# EasyEDA Pro project ProPrj_LoRA Transmitter Atmega328u_2025-11-03.epro

# Schematic Schematic1
Board Name: Board1; Create Date: 2025-08-10; Page Name: P1; Project Name: LoRA Transmitter Atmega328u; Schematic Name: Schematic1; Update Date: 2025-08-22; Company: Phil Grant; Page Size: A4; Version: V1.0
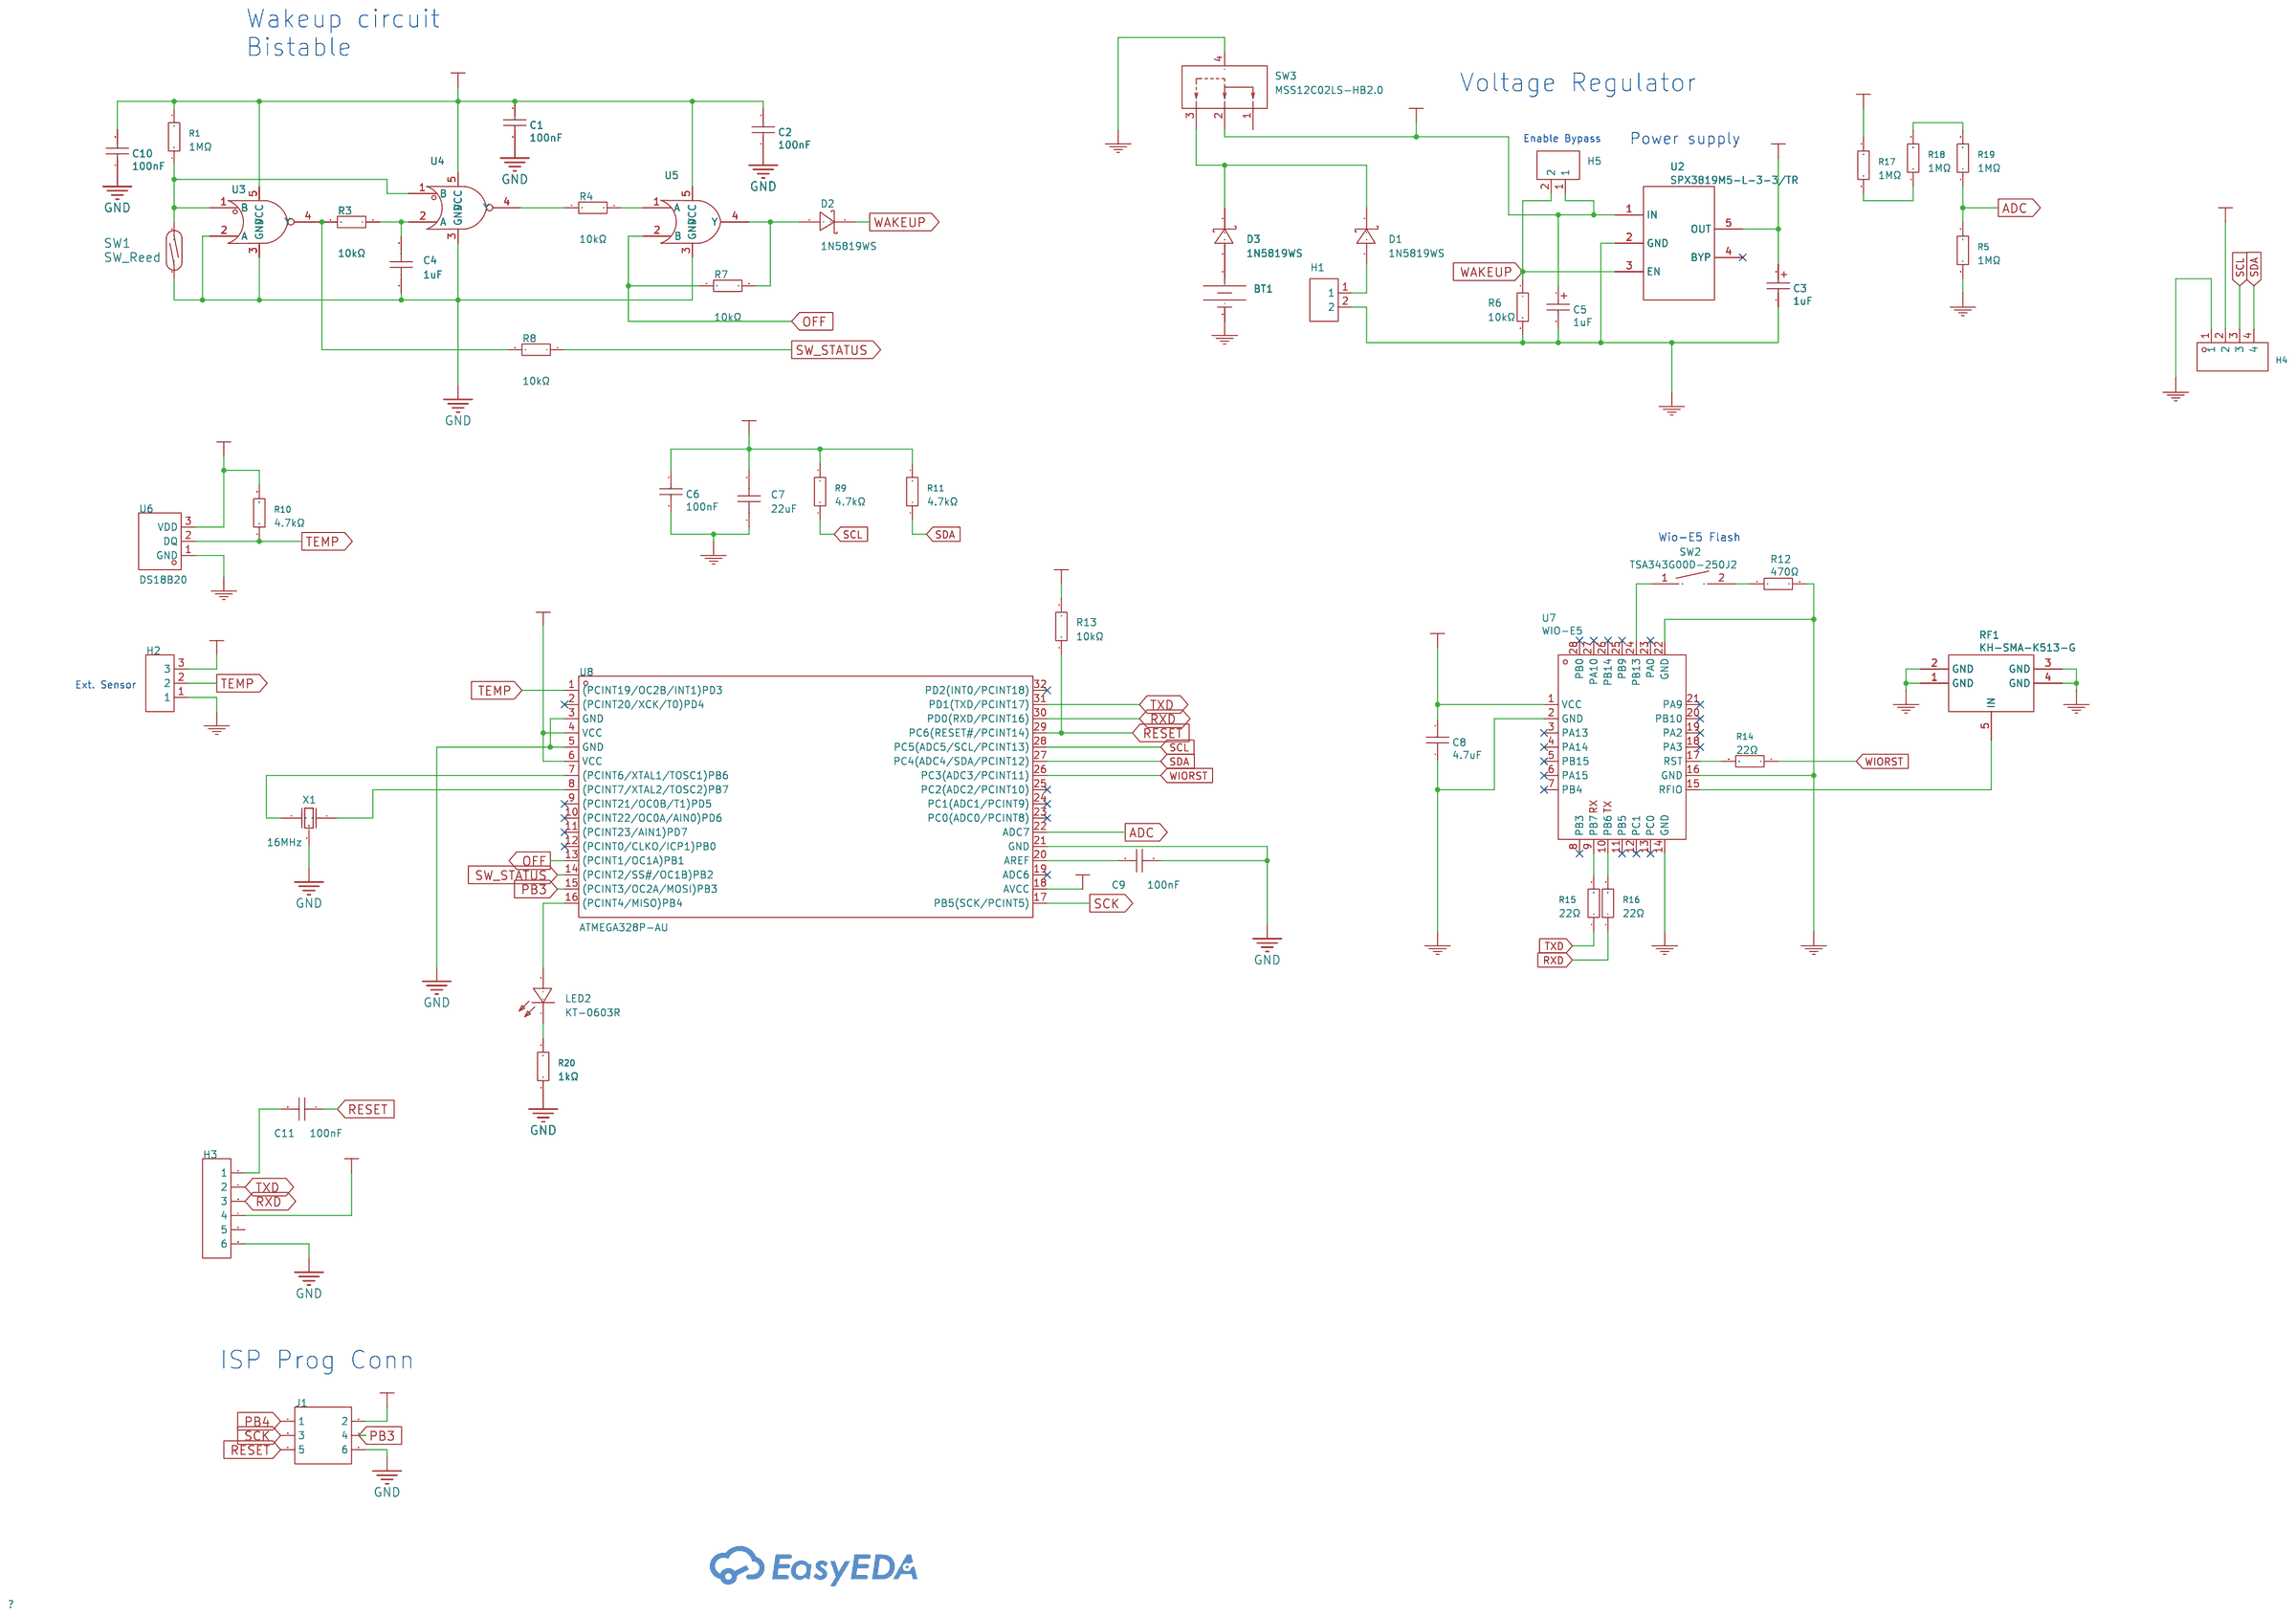
[diagram p0: schematic sheet]

## Parts
BT1  BH-18650-4  [BAT-SMD_BH-18650-4]  (no BOM)
C1  100nF  [C0402]
C2  100nF  [C0402]
C3  1uF  [CASE-A_3216]
C4  1uF  [C0402]
C5  1uF  [CASE-A_3216]
C6  100nF  [C0402]
C7  22uF  [C0603]
C8  4.7uF  [C0603]
C9  100nF  [C0402]
C10  100nF  [C0402]
C11  100nF  [C0402]
D1  1N5819WS  [SOD-323_L1.8-W1.3-LS2.5-RD]
D2  1N5819WS  [SOD-323_L1.8-W1.3-LS2.5-RD]
D3  1N5819WS  [SOD-323_L1.8-W1.3-LS2.5-RD]
H1  PZ254V-11-02P  [HDR-TH_2P-P2.54-V-M]  (no BOM)
H2  PZ254V-11-03P  [HDR-TH_3P-P2.54-V-M]  (no BOM)
H3  2.54-1x6P直针  [HDR-TH_6P-P2.54-V-M-1]  (no BOM)
H4  PZ254V-11-04P  [HDR-TH_4P-P2.54-V-M]  (no BOM)
H5  PZ254V-11-02P  [HDR-TH_2P-P2.54-V-M]  (no BOM)
J1  2.54-2*3P针  [HDR-TH_6P-P2.54-V-M-R2-C3-S2.54-1]  (no BOM)
LED2  KT-0603R  [LED0603-RD]
R1  1MΩ  [R0402]
R3  10kΩ  [R0402]
R4  10kΩ  [R0402]
R5  1MΩ  [R0402]
R6  10kΩ  [R0402]  (no BOM)
R7  10kΩ  [R0402]
R8  10kΩ  [R0402]
R9  4.7kΩ  [R0402]
R10  4.7kΩ  [R0402]
R11  4.7kΩ  [R0402]
R12  470Ω  [R0603]
R13  10kΩ  [R0402]
R14  22Ω  [R0402]
R15  22Ω  [R0402]
R16  22Ω  [R0402]
R17  1MΩ  [R0402]
R18  1MΩ  [R0402]
R19  1MΩ  [R0402]
R20  1kΩ  [R0402]
RF1  KH-SMA-K513-G  [ANT-TH_KH-SMA-K513-G]  (no BOM)
SW1  SW_Reed  [SW-SMD_2P-L17.0-W3.1_REED_SWITCH_17MM]  (no BOM)
SW2  TSA343G00D-250J2  [SW-SMD_L4.0-W2.9-P4.15-EH]
SW3  MSS12C02LS-HB2.0  [SW-SMD_MSS12C02LS-HB2.0-1]
U2  SPX3819M5-L-3-3/TR  [SOT-23-5_L3.0-W1.7-P0.95-LS2.8-BL]
U3  74AHC1G86GW,125  [SOT-353-5_L2.0-W1.3-P0.65-LS2.1-BR]
U4  74AHC1G86GW,125  [SOT-353-5_L2.0-W1.3-P0.65-LS2.1-BR]
U5  SN74AHC1G32DBVR  [SOT-23-5_L3.0-W1.7-P0.95-LS2.8-BR]
U6  DS18B20  [TO-92-3_L4.5-W3.5-P1.27-L]  (no BOM)
U7  WIO-E5  [SMD-28_L12.0-W12.0-P1.25_LORA-E5]  (no BOM)
U8  ATMEGA328P-AU  [TQFP-32_L7.0-W7.0-P0.80-LS9.0-BL]
X1  16MHz  [OSC-SMD_3P-L3.2-W1.3-P1.20-L]

## Library data of the parts
BT1 = BH-18650-4: Supplier Part: C49118399; Manufacturer: HanElectricity(瀚源); Supplier Footprint: SMD; JLCPCB Part Class: Extended Part; Datasheet: https://atta.szlcsc.com/upload/public/pdf/source/20250610/E24A298F5E17B230207136FA3E112EAA.pdf; Supplier: LCSC
C1 C2 C6 C9-C11 = CL05B104KO5NNNC: Capacitance: Tolerance:±10% Tolerance:±10% Voltage Rated: Temperature Coefficient:; LCSC Part Name: 100nF ±10% 16V; Supplier Part: C1525; Manufacturer: SAMSUNG(三星); Supplier Footprint: 0402; JLCPCB Part Class: Basic Part; Datasheet: https://atta.szlcsc.com/upload/public/pdf/source/20160218/1457707763339.pdf; Supplier: LCSC; Tolerance: ±10%
C3 C5 = 1uF: Supplier: LCSC; Manufacturer: Kyocera AVX; Manufacturer Part: TAJA105K035RNJ; Supplier Part: C7176; JLCPCB Part Class: Extended Part
C4 = CL05A105KA5NQNC: Capacitance:1uF Tolerance:±10% Tolerance:±10% Voltage Rating:25V Temperature Coefficient:X5R; LCSC Part Name: 1uF ±10% 25V; Supplier Part: C52923; Manufacturer: SAMSUNG(三星); Supplier Footprint: 0402; JLCPCB Part Class: Basic Part; Datasheet: https://item.szlcsc.com/datasheet/CL05A105KA5NQNC/53938.html; Supplier: LCSC; Tolerance: ±10%; Voltage Rating: 25V; Temperature Coefficient: X5R
C7 = CL10A226MQ8NRNC: Capacitance: Tolerance:±20% Tolerance:±20% Voltage Rated: Temperature Coefficient:; LCSC Part Name: 22uF ±20% 6.3V; Supplier Part: C59461; Manufacturer: SAMSUNG(三星); Supplier Footprint: 0603; JLCPCB Part Class: Basic Part; Datasheet: https://atta.szlcsc.com/upload/public/pdf/source/20160218/1457707763339.pdf; Supplier: LCSC; Tolerance: ±20%
C8 = 4.7uF: Supplier: LCSC; Manufacturer Part: CL10A475KO8NNNC; Manufacturer: SAMSUNG(三星); Supplier Part: C19666; JLCPCB Part Class: Basic Part
D1-D3 = 1N5819WS_C191023: Forward Voltage (Vf@If):600mV@1A Reverse Voltage (Vr):40V Rectified Current:1A; LCSC Part Name: 电压:40V 电流:1A; Supplier Part: C191023; Manufacturer: Hottech(合科泰); Supplier Footprint: SOD-323; JLCPCB Part Class: Basic Part; Datasheet: https://atta.szlcsc.com/upload/public/pdf/source/20220428/3CB86FD8D28D653594B4E35F9D5AEFD9.pdf; Supplier: LCSC; Forward Voltage (Vf@If): 600mV@1A; Reverse Voltage (Vr): 40V; Rectified Current: 1A
H1 H5 = PZ254V-11-02P: Pin Structure:1x2P Pitch:2.54mm Row Spacing:- Circluar Pins/Square Pins:Policy Mounting Type:Straight Number of Rows:Single Row Number of Pins:2P Current Rating:- Voltage Rating (Max):- Length of Mating Pin:6mm Insulation Height:2.5mm Length of End Connec; LCSC Part Name: 1x2P 间距:2.54mm 方针 直插; Supplier Part: C492401; Manufacturer: XFCN(兴飞); Supplier Footprint: 插件,P=2.54mm; JLCPCB Part Class: Extended Part; Datasheet: https://atta.szlcsc.com/upload/public/pdf/source/20200309/C492401_A812433581A9B211A7FFA413ADDFF0E5.pdf; Supplier: LCSC; Pin Structure: 1x2P; Pitch: 2.54mm; Circluar Pins/Square Pins: Policy; Mounting Type: Straight; Number of Rows: Single Row; Number of Pins: 2P; Length of Mating Pin: 6mm; Insulation Height: 2.5mm; Length of End Connection Pin: 3mm; Contact Material: Brass; Operating Temperature: -40℃~+105℃; Color: Black
H2 = PZ254V-11-03P: Pin Structure:1x3P Pitch:2.54mm Row Spacing:- Circluar Pins/Square Pins:Policy Mounting Type:Straight Number of Rows:Single Row Number of Pins:3P Current Rating:3A Voltage Rating (Max):250V Length of Mating Pin:6mm Insulation Height:2.5mm Length of End Co; LCSC Part Name: 1x3P 间距:2.54mm 方针 直插; Supplier Part: C2937625; Manufacturer: XFCN(兴飞); Supplier Footprint: 插件,P=2.54mm; JLCPCB Part Class: Extended Part; Datasheet: https://atta.szlcsc.com/upload/public/pdf/source/20200309/C492402_8335C3D49C4E4C618838D59BB1D024C1.pdf; Supplier: LCSC; Pin Structure: 1x3P; Pitch: 2.54mm; Circluar Pins/Square Pins: Policy; Mounting Type: Straight; Number of Rows: Single Row; Number of Pins: 3P; Current Rating: 3A; Voltage Rating (Max): 250V; Length of Mating Pin: 6mm; Insulation Height: 2.5mm; Length of End Connection Pin: 3mm; Operating Temperature: -40℃~+105℃; Color: Black
H3 = 2.54-1x6P直针: Pin Structure:1x6P Pitch:2.54mm Row Spacing:- Circluar Pins/Square Pins:Policy Mounting Type:Straight Number of Rows:Single Row Number of Pins:6P Current Rating:3A Voltage Rating (Max):- Length of Mating Pin:- Insulation Height:- Contact Material:Brass Co; LCSC Part Name: 1x6P 间距:2.54mm 方针 直插; Supplier Part: C37208; Manufacturer: BOOMELE(博穆精密); Supplier Footprint: 插件,P=2.54mm; JLCPCB Part Class: Extended Part; Datasheet: https://atta.szlcsc.com/upload/public/pdf/source/20250115/42A019761A40C8B839643401D8CA5A96.pdf; Supplier: LCSC; Pin Structure: 1x6P; Pitch: 2.54mm; Circluar Pins/Square Pins: Policy; Mounting Type: Straight; Number of Rows: Single Row; Number of Pins: 6P; Current Rating: 3A; Contact Material: Brass; Operating Temperature: -40℃~+105℃; Color: Black
H4 = PZ254V-11-04P: Pin Structure:1x4P Pitch:2.54mm Row Spacing:- Circluar Pins/Square Pins:Square Pins Mounting Type:Straight Number of Rows:Plugin Number of Pins:4P Current Rating (Max):3A Voltage Rating (Max):250V Length of Mating Pin:6mm Insulation Height:2.5mm Length of; LCSC Part Name: 间距:2.54mm 1x4P 直插 方针; Supplier Part: C2691448; Manufacturer: XFCN(兴飞); Supplier Footprint: 插件,P=2.54mm; JLCPCB Part Class: Extended Part; Datasheet: https://atta.szlcsc.com/upload/public/pdf/source/20200309/C492403_F9F19131791D08044AD4F84F8E751A34.pdf; Supplier: LCSC; Pin Structure: 1x4P; Pitch: 2.54mm; Circluar Pins/Square Pins: Square Pins; Mounting Type: Straight; Number of Rows: Plugin; Number of Pins: 4P; Current Rating (Max): 3A; Voltage Rating (Max): 250V; Length of Mating Pin: 6mm; Insulation Height: 2.5mm; Length of End Connection Pin: 3mm; Operating Temperature Range: -40℃~+105℃; Color: Black
J1 = 2.54-2*3P针: Pin Structure:- Pitch:2.54mm Row Spacing:- Circluar Pins/Square Pins:- Mounting Type:Straight Number of Rows:Double Row Number of Pins:6P Current Rating:- Voltage Rating (Max):- Length of Mating Pin:- Insulation Height:- Contact Material:- Contact Plating; LCSC Part Name: 间距:2.54mm 直插; Supplier Part: C65114; Manufacturer: BOOMELE(博穆精密); Supplier Footprint: 插件,P=2.54mm; JLCPCB Part Class: Extended Part; Supplier: LCSC; Pitch: 2.54mm; Mounting Type: Straight; Number of Rows: Double Row; Number of Pins: 6P; Color: Black
LED2 = KT-0603R: Emitted Color:Red Power Dissipation:- Forward Current:- Dominant Wavelength:- Dominant Wavelength:- Peak Wavelength:- Diode Configuration:- Lens Color:- Color Temperature:- Color Temperature:- Viewing Angle:- Mounting Sytle:- Operating Temperature:-40℃~+8; LCSC Part Name: 0603 红灯 高亮; Supplier Part: C2286; Manufacturer: KENTO; Supplier Footprint: 0603; JLCPCB Part Class: Basic Part; Datasheet: https://atta.szlcsc.com/upload/public/pdf/source/20160616/1466072038404.pdf; Supplier: LCSC; Emitted Color: Red; Operating Temperature: -40℃~+85℃
R1 R5 R17-R19 = 0402WGF1004TCE: Type:Thick Film Resistors Resistance:1MΩ Tolerance:±1% Tolerance:±1% Power(Watts): Overload Voltage (Max): Temperature Coefficient:±100ppm/℃ Temperature Coefficient:±100ppm/℃ Operating Temperature Range:-55℃~+155℃ Operating Temperature Range:-55℃~+155℃; LCSC Part Name: 1MΩ ±1% 62.5mW 厚膜电阻; Supplier Part: C26083; Manufacturer: UNI-ROYAL(厚声); Supplier Footprint: 0402; JLCPCB Part Class: Basic Part; Datasheet: https://atta.szlcsc.com/upload/public/pdf/source/20200306/C422600_1E6D84923E4A46A82E41ADD87F860B5C.pdf; Supplier: LCSC; Type: Thick Film Resistors; Tolerance: ±1%; Temperature Coefficient: ±100ppm/℃; Operating Temperature Range: -55℃~+155℃
R3 R4 R6-R8 R13 = 0402WGF1002TCE: Type:Thick Film Resistors Resistance:10kΩ Tolerance:±1% Tolerance:±1% Power(Watts): Overload Voltage (Max): Temperature Coefficient:±100ppm/℃ Temperature Coefficient:±100ppm/℃ Operating Temperature Range:-55℃~+155℃ Operating Temperature Range:-55℃~+155℃; LCSC Part Name: 10kΩ ±1% 62.5mW 厚膜电阻; Supplier Part: C25744; Manufacturer: UNI-ROYAL(厚声); Supplier Footprint: 0402; JLCPCB Part Class: Basic Part; Datasheet: https://atta.szlcsc.com/upload/public/pdf/source/20200306/C422600_1E6D84923E4A46A82E41ADD87F860B5C.pdf; Supplier: LCSC; Type: Thick Film Resistors; Tolerance: ±1%; Temperature Coefficient: ±100ppm/℃; Operating Temperature Range: -55℃~+155℃
R9-R11 = 0402WGF4701TCE: Type:Thick Film Resistors Resistance:4.7kΩ Tolerance:±1% Tolerance:±1% Power(Watts): Overload Voltage (Max): Temperature Coefficient:±100ppm/℃ Temperature Coefficient:±100ppm/℃ Operating Temperature Range:-55℃~+155℃ Operating Temperature Range:-55℃~+155℃; LCSC Part Name: 4.7kΩ ±1% 62.5mW 厚膜电阻; Supplier Part: C25900; Manufacturer: UNI-ROYAL(厚声); Supplier Footprint: 0402; JLCPCB Part Class: Basic Part; Datasheet: https://atta.szlcsc.com/upload/public/pdf/source/20200306/C422600_1E6D84923E4A46A82E41ADD87F860B5C.pdf; Supplier: LCSC; Type: Thick Film Resistors; Tolerance: ±1%; Temperature Coefficient: ±100ppm/℃; Operating Temperature Range: -55℃~+155℃
R12 = 470Ω: Supplier Part: C23179; Supplier: LCSC; Manufacturer: UniOhm; Manufacturer Part: 0603WAF4700T5E
R14-R16 = 0402WGF220JTCE: Type:Thick Film Resistors Resistance:22Ω Tolerance:±1% Tolerance:±1% Power(Watts): Overload Voltage (Max): Temperature Coefficient:±100ppm/℃ Temperature Coefficient:±100ppm/℃ Operating Temperature Range:-55℃~+155℃ Operating Temperature Range:-55℃~+155℃; LCSC Part Name: 22Ω ±1% 62.5mW 厚膜电阻; Supplier Part: C25092; Manufacturer: UNI-ROYAL(厚声); Supplier Footprint: 0402; JLCPCB Part Class: Basic Part; Datasheet: https://atta.szlcsc.com/upload/public/pdf/source/20200306/C422600_1E6D84923E4A46A82E41ADD87F860B5C.pdf; Supplier: LCSC; Type: Thick Film Resistors; Tolerance: ±1%; Temperature Coefficient: ±100ppm/℃; Operating Temperature Range: -55℃~+155℃
R20 = 0402WGF1001TCE: Type:Thick Film Resistors Resistance:1kΩ Tolerance:±1% Tolerance:±1% Power(Watts): Overload Voltage (Max): Temperature Coefficient:±100ppm/℃ Temperature Coefficient:±100ppm/℃ Operating Temperature Range:-55℃~+155℃ Operating Temperature Range:-55℃~+155℃; LCSC Part Name: 1kΩ ±1% 62.5mW 厚膜电阻; Supplier Part: C11702; Manufacturer: UNI-ROYAL(厚声); Supplier Footprint: 0402; JLCPCB Part Class: Basic Part; Datasheet: https://atta.szlcsc.com/upload/public/pdf/source/20200306/C422600_1E6D84923E4A46A82E41ADD87F860B5C.pdf; Supplier: LCSC; Type: Thick Film Resistors; Tolerance: ±1%; Temperature Coefficient: ±100ppm/℃; Operating Temperature Range: -55℃~+155℃
RF1 = KH-SMA-K513-G: Supplier: LCSC; Supplier Part: C411575; Manufacturer: kinghelm(金航标); JLCPCB Part Class: Extended Part
SW1 = Switch_SW_Reed
SW2 = TSA343G00D-250J2: Supplier: LCSC; Supplier Part: C354947; Manufacturer: BRIGHT(博瑞泰); JLCPCB Part Class: Extended Part
SW3 = MSS12C02LS-HB2.0: Circuit:SPDT Actuator Style:- Pin Style:SMDSplicing Switch Length:6.65mm Switch Width:2.75mm Switch Height:1.4mm Mounting Style:Brick nogging Actuator Color:- Current Rating (DC):100mA Voltage Rating (DC):12V Current Rating (AC):- Voltage Rating (AC):- Me; Supplier Part: C3008584; Manufacturer: SHOU HAN(首韩); Supplier Footprint: SMD; JLCPCB Part Class: Extended Part; Datasheet: https://atta.szlcsc.com/upload/public/pdf/source/20220429/BFCDDD0B2B8AA13C13326050C46E8D37.pdf; Supplier: LCSC; Circuit: SPDT; Pin Style: SMDSplicing; Switch Length: 6.65mm; Switch Width: 2.75mm; Switch Height: 1.4mm; Mounting Style: Brick nogging; Current Rating (DC): 100mA; Voltage Rating (DC): 12V; Mechanical Life: 1万次; Operating Temperature: -25℃~+70℃
U2 = SPX3819M5-L-3-3/TR: Supplier: LCSC; Manufacturer: MaxLinear; Supplier Part: C9055; JLCPCB Part Class: Extended Part
U3 U4 = 74AHC1G86GW,125: Supplier Part: C554319; Manufacturer: Nexperia(安世); Supplier Footprint: SOT-353-5; JLCPCB Part Class: Extended Part; Datasheet: https://atta.szlcsc.com/upload/public/pdf/source/20240724/18B5C205BE196282D741480208CB99EB.pdf; Supplier: LCSC
U5 = SN74AHC1G32DBVR: Logic Gate Type:ORGate Number of Channels:1 Supply Voltage:2V~5.5V Supply Voltage:2V~5.5V Quiescent Current (Max):1uA Sink Current:8mA Source Current:8mA High Level Range (VIH):1.5V~3.85V High Level Range (VIH):1.5V~3.85V Low Level Range (VIL):500mV~1.65V; Supplier Part: C7470; Manufacturer: TI(德州仪器); Supplier Footprint: SOT-23-5; JLCPCB Part Class: Extended Part; Datasheet: https://www.ti.com/cn/lit/gpn/sn74ahc1g32; Supplier: LCSC; Logic Gate Type: ORGate; Number of Channels: 1; Supply Voltage: 2V~5.5V; Quiescent Current (Max): 1uA; Sink Current: 8mA; Source Current: 8mA; High Level Range (VIH): 1.5V~3.85V; Low Level Range (VIL): 500mV~1.65V; Series: 74AHCSeries; Propagation Delay Time: 7.5ns@5V,50pF; Operating Temperature: -40℃~+85℃
U6 = DS18B20_C5451632: Temperature Range:- Temperature Range:- Tolerance:±0.4℃ Tolerance:±0.4℃ Voltage - Supply:2.5V~5.5V Voltage - Supply:2.5V~5.5V Standby Current:- Interface:- Temperature Conversion Time:- Temperature Resolution:-; LCSC Part Name: 温度-10℃~70℃ 精度±0.4℃ 电压2.5V~5.5V; Supplier Part: C5451632; Manufacturer: HXY MOSFET(华轩阳电子); Supplier Footprint: TO-92; JLCPCB Part Class: Extended Part; Datasheet: https://atta.szlcsc.com/upload/public/pdf/source/20230427/F43BF9FBC8AD29BCFCC811AFA154CBDD.pdf; Supplier: LCSC; Tolerance: ±0.4℃; Voltage - Supply: 2.5V~5.5V
U7 = WIO-E5: Supplier: LCSC; Supplier Part: C19632849; Manufacturer: null; Manufacturer Part: LoRa-E5; JLCPCB Part Class: Extended Part
U8 = ATMEGA328P-AU_C14877: CPU Core:AVR Program Storage Size:32KB RAM Size:2KB GPIO Ports Number:23 Operating Voltage Range:1.8V~5.5V Operating Voltage Range:1.8V~5.5V CPU Maximum Speed:20MHz Program Memory Type:FLASH EEPROM:1KB Operating Temperature Range:-40℃~+85℃ Operating Tempe; LCSC Part Name: 基于AVR增强型RISC架构的低功耗CMOS 8位微控制器; Supplier Part: C14877; Manufacturer: MICROCHIP(美国微芯); Supplier Footprint: TQFP-32(7x7); JLCPCB Part Class: Extended Part; Datasheet: https://atta.szlcsc.com/upload/public/pdf/source/20140621/1457707095197.pdf; Supplier: LCSC; CPU Core: AVR; Program Storage Size: 32KB; RAM Size: 2KB; GPIO Ports Number: 23; Operating Voltage Range: 1.8V~5.5V; CPU Maximum Speed: 20MHz; Program Memory Type: FLASH; EEPROM: 1KB; Operating Temperature Range: -40℃~+85℃; ADC (Bit): 10bit; Peripheral/Function: WDT；PWM；WDT；PWM; Watchdog: 有; Low-Voltage Detect: 有; Internal Oscillator: 有
X1 = CSTNE16M0V53L000R0: Frequency: Built-in Load Capacitance: Resonant Impedance: Operating Temperature:-40℃~+85℃ Operating Temperature:-40℃~+85℃; LCSC Part Name: 16MHz ±0.5% 内置负载电容:15pF; Supplier Part: C1870467; Manufacturer: muRata(村田); Supplier Footprint: SMD3213-3P; JLCPCB Part Class: Extended Part; Datasheet: https://atta.szlcsc.com/upload/public/pdf/source/20230811/C69D5D7CD0DA11F4013861B71EB4B4F6.pdf; Supplier: LCSC; Operating Temperature: -40℃~+85℃

## Nets
GND: BT1.2(-) C1.1 C2.1 C3.2 C4.1 C5.2 C6.1 C7.1 C8.1 C9.1 C10.1 H1.2 H2.1 H3.6 H4.1 J1.6 R5.1 R6.2 R12.2 R20.1 RF1.1(GND) RF1.2(GND) RF1.3(GND) RF1.4(GND) SW1.1 SW3.4 U2.2(GND) U3.2(A) U3.3(GND) U4.3(GND) U5.3(GND) U6.1(GND) U7.2(GND) U7.14(GND) U7.16(GND) U7.22(GND) U8.3(GND) U8.5(GND) U8.21(GND) X1.2(GND)
VBATT: C1.2 C2.2 C5.1 C10.2 H5.1 R1.2 R17.2 SW3.2 U2.1(IN) U3.5(VCC) U4.5(VCC) U5.5(VCC)
VCC: C3.1 C6.2 C7.2 C8.2 H2.3 H3.4 H4.2 J1.2 R9.2 R10.2 R11.2 R13.2 U2.5(OUT) U6.3(VDD) U7.1(VCC) U8.4(VCC) U8.6(VCC) U8.18(AVCC)
ADC: R5.2 R19.1 U8.22(ADC7)
OFF: R7.2 U5.2(B) U8.13((PCINT1/OC1A)PB1)
PB3: J1.4 U8.15((PCINT3/OC2A/MOSI)PB3)
PB4: J1.1
RESET: C11.1 J1.5 R13.1 U8.29(PC6(RESET#/PCINT14))
RXD: H3.3 R16.1 U8.30(PD0(RXD/PCINT16))
SCK: J1.3 U8.17(PB5(SCK/PCINT5))
SCL: H4.3 R9.1 U8.28(PC5(ADC5/SCL/PCINT13))
SDA: H4.4 R11.1 U8.27(PC4(ADC4/SDA/PCINT12))
SW_STATUS: R8.1 U8.14((PCINT2/SS#/OC1B)PB2)
TEMP: H2.2 R10.1 U6.2(DQ) U8.1((PCINT19/OC2B/INT1)PD3)
TXD: H3.2 R15.1 U8.31(PD1(TXD/PCINT17))
WAKEUP: D2.1(K) H5.2 R6.1 U2.3(EN)
WIORST: R14.1 U8.26(PC3(ADC3/PCINT11))
$1N10294: U8.7((PCINT6/XTAL1/TOSC1)PB6) X1.3(OSC2)
$1N16067: U8.8((PCINT7/XTAL2/TOSC2)PB7) X1.1(OSC1)
$1N25630: C9.2 U8.20(AREF)
$1N31677: RF1.5(IN) U7.15(RFIO)
$1N31679: R12.1 SW2.2
$1N31680: SW2.1 U7.24(PB13)
$1N31682: R14.2 U7.17(RST)
$1N31686: R16.2 U7.10(PB6)
$1N31687: R15.2 U7.9(PB7)
$1N33212: D1.2(A) H1.1
$1N40469: R4.1 U5.1(A)
$1N40521: C4.2 R3.1 U4.2(A)
$1N40626: R4.2 U4.4(Y)
$1N40794: R1.1 SW1.2 U3.1(B) U4.1(B)
$1N41071: R3.2 R8.2 U3.4(Y)
$1N41432: D2.2(A) R7.1 U5.4(Y)
$1N45378: BT1.1(+) D3.2(A)
$1N45496: R17.1 R18.1
$1N45505: R18.2 R19.2
$1N45731: D1.1(K) D3.1(K) SW3.3
$1N46027: LED2.2(A) U8.16((PCINT4/MISO)PB4)
$1N46075: LED2.1(K) R20.2
$1N46271: C11.2 H3.1

Not connected (* = marked no-connect by the designer): H3 5; SW3 1; U2 4(BYP)*; U7 3(PA13)* 4(PA14)* 5(PB15)* 6(PA15)* 7(PB4)* 8(PB3)* 11(PB5)* 12(PC1)* 13(PC0)* 18(PA3)* 19(PA2)* 20(PB10)* 21(PA9)* 23(PA0)* 25(PB9)* 26(PB14)* 27(PA10)* 28(PB0)*; U8 2((PCINT20/XCK/T0)PD4)* 9((PCINT21/OC0B/T1)PD5)* 10((PCINT22/OC0A/AIN0)PD6)* 11((PCINT23/AIN1)PD7)* 12((PCINT0/CLKO/ICP1)PB0)* 19(ADC6)* 23(PC0(ADC0/PCINT8))* 24(PC1(ADC1/PCINT9))* 25(PC2(ADC2/PCINT10))* 32(PD2(INT0/PCINT18))*

## Notes on the sheet
- Wakeup circuit
  Bistable
- Voltage Regulator
- Enable Bypass
- Power supply
- Wio-E5 Flash
- Ext. Sensor
- ISP Prog Conn

# Board PCB1
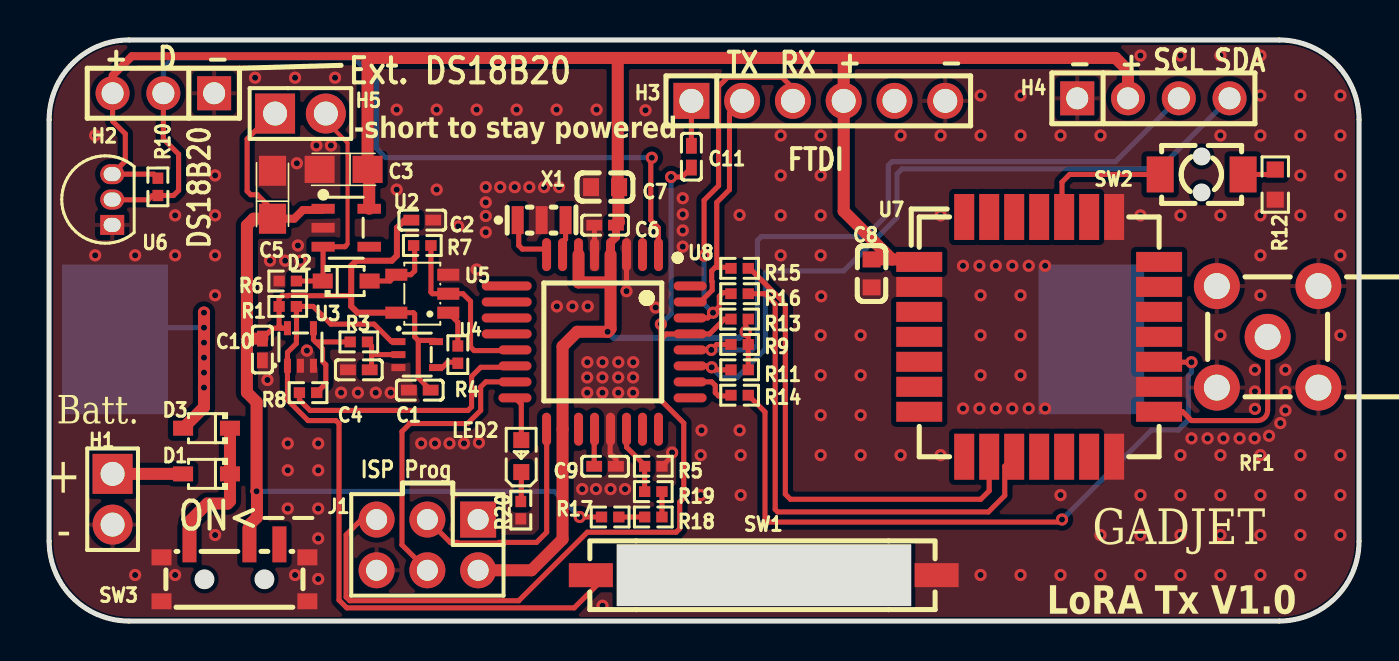
[diagram p1: board, top side]
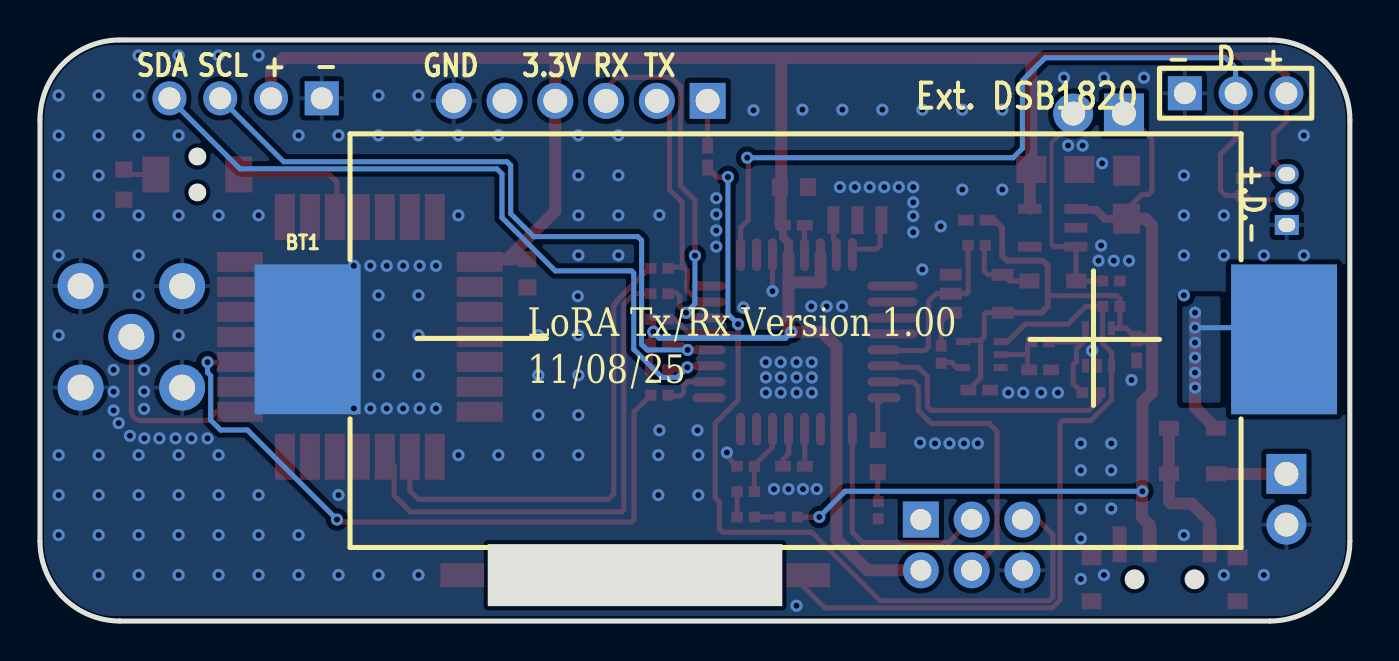
[diagram p2: board, bottom side, seen from below]

Outline 65.53 x 29.08 mm; copper layers: Top Layer, Bottom Layer. Coordinates in mm from the lower left corner of the outline.
Outline path: 0,25.08 0,4 arc(1.17,1.17) 4,0 61.53,0 arc(64.36,1.17) 65.53,4 65.53,25.08 arc(64.36,27.91) 61.53,29.08 4,29.08 arc(1.17,27.91) 0,25.08
Stack: Top Layer 0.035mm / Dielectric1 1.51mm FR4 er 4.5 / Bottom Layer 0.035mm

## Design rules (mm)
template: Custom Config
spacing copperThickness1oz (default): track to track 0.102, other pairs 0.152 to 0.3
spacing copperThickness2oz: track to track 0.203, other pairs 0.152 to 0.3
track width copperThickness1oz (default): min 0.127, default 0.254, max 2.54
track width copperThickness2oz: min 0.203, default 0.254, max 2.54
differential pair differentialPair (default): width min 0.127, default 0.254, max 2.54; gap min 0.152, default 0.152
via viaSize (default): diameter min 0.5, default 0.61, max 10; hole min 0.3, default 0.305, max 6.3

## Placement (name value [footprint] x y rotation side)
BT1  BH-18650-4  [BAT-SMD_BH-18650-4]  43.94 14.1 180 bottom
C1  100nF  [C0402]  18.54 11.56 0 top
C2  100nF  [C0402]  18.67 20.07 180 top
C3  1uF  [CASE-A_3216]  14.73 22.61 180 top
C4  1uF  [C0402]  15.49 12.57 0 top
C5  1uF  [CASE-A_3216]  11.18 21.34 90 top
C6  100nF  [C0402]  27.81 19.81 0 top
C7  22uF  [C0603]  27.81 21.72 0 top
C8  4.7uF  [C0603]  41.15 17.4 90 top
C9  100nF  [C0402]  27.81 7.75 180 top
C10  100nF  [C0402]  10.67 13.59 90 top
C11  100nF  [C0402]  32.13 23.24 90 top
D1  1N5819WS  [SOD-323_L1.8-W1.3-LS2.5-RD]  7.87 7.37 180 top
D2  1N5819WS  [SOD-323_L1.8-W1.3-LS2.5-RD]  14.86 17.02 0 top
D3  1N5819WS  [SOD-323_L1.8-W1.3-LS2.5-RD]  7.87 9.65 180 top
H1  PZ254V-11-02P  [HDR-TH_2P-P2.54-V-M]  3.17 6.1 270 top
H2  PZ254V-11-03P  [HDR-TH_3P-P2.54-V-M]  5.72 26.42 180 top
H3  2.54-1x6P直针  [HDR-TH_6P-P2.54-V-M-1]  38.48 26.03 0 top
H4  PZ254V-11-04P  [HDR-TH_4P-P2.54-V-M]  55.25 26.16 0 top
H5  PZ254V-11-02P  [HDR-TH_2P-P2.54-V-M]  12.57 25.4 0 top
J1  2.54-2*3P针  [HDR-TH_6P-P2.54-V-M-R2-C3-S2.54-1]  18.92 3.81 180 top
LED2  KT-0603R  [LED0603-RD]  23.62 8.25 90 top
R1  1MΩ  [R0402]  11.94 15.75 180 top
R3  10kΩ  [R0402]  15.49 13.97 180 top
R4  10kΩ  [R0402]  20.45 13.33 270 top
R5  1MΩ  [R0402]  30.23 7.75 180 top
R6  10kΩ  [R0402]  11.94 17.02 180 top
R7  10kΩ  [R0402]  18.67 18.8 0 top
R8  10kΩ  [R0402]  12.95 11.43 0 top
R9  4.7kΩ  [R0402]  34.54 13.84 0 top
R10  4.7kΩ  [R0402]  5.44 21.73 90 top
R11  4.7kΩ  [R0402]  34.54 12.57 0 top
R12  470Ω  [R0603]  61.34 21.84 270 top
R13  10kΩ  [R0402]  34.54 15.11 0 top
R14  22Ω  [R0402]  34.54 11.3 0 top
R15  22Ω  [R0402]  34.54 17.65 0 top
R16  22Ω  [R0402]  34.54 16.38 0 top
R17  1MΩ  [R0402]  28.07 5.21 180 top
R18  1MΩ  [R0402]  30.23 5.21 0 top
R19  1MΩ  [R0402]  30.23 6.48 0 top
R20  1kΩ  [R0402]  23.6 5.55 90 top
RF1  KH-SMA-K513-G  [ANT-TH_KH-SMA-K513-G]  60.96 14.22 180 top
SW1  SW_Reed  [SW-SMD_2P-L17.0-W3.1_REED_SWITCH_17MM]  35.69 2.29 180 top
SW2  TSA343G00D-250J2  [SW-SMD_L4.0-W2.9-P4.15-EH]  57.66 22.35 0 top
SW3  MSS12C02LS-HB2.0  [SW-SMD_MSS12C02LS-HB2.0-1]  9.27 2.41 180 top
U2  SPX3819M5-L-3-3/TR  [SOT-23-5_L3.0-W1.7-P0.95-LS2.8-BL]  14.86 19.69 270 top
U3  74AHC1G86GW,125  [SOT-353-5_L2.0-W1.3-P0.65-LS2.1-BR]  12.57 13.72 270 top
U4  74AHC1G86GW,125  [SOT-353-5_L2.0-W1.3-P0.65-LS2.1-BR]  18.41 13.33 180 top
U5  SN74AHC1G32DBVR  [SOT-23-5_L3.0-W1.7-P0.95-LS2.8-BR]  18.67 16.38 0 top
U6  DS18B20  [TO-92-3_L4.5-W3.5-P1.27-L]  3.16 21.1 90 top
U7  WIO-E5  [SMD-28_L12.0-W12.0-P1.25_LORA-E5]  49.53 14.22 0 top
U8  ATMEGA328P-AU  [TQFP-32_L7.0-W7.0-P0.80-LS9.0-BL]  27.69 13.97 180 top
X1  16MHz  [OSC-SMD_3P-L3.2-W1.3-P1.20-L]  24.64 20.07 0 top

## Footprints (pads in the part's own frame, mm; a bottom-side part is the same pattern mirrored in y, then rotated)
ANT-TH_KH-SMA-K513-G
  round 2.3 hole 1.3: 1(-2.54,-2.54) 2(-2.54,2.54) 3(2.54,2.54) 4(2.54,-2.54) 5(0,0)
BAT-SMD_BH-18650-4
  rect 5.3x7.5 smd: 1(40.65,0) 2(-8.2,0)
C0402
  rect 0.79x0.54 smd: 1(-0.545,0) 2(0.545,0)
C0603
  rect 0.8x0.9 smd: 1(-0.7,0) 2(0.7,0)
CASE-A_3216
  rect 1.5x1.359 smd: 1(-1.2,0) 2(1.2,0)
HDR-TH_2P-P2.54-V-M
  rect 2x2 hole 1.2: 1(-1.27,0)
  round 2 hole 1.2: 2(1.27,0)
HDR-TH_3P-P2.54-V-M
  rect 1.7x1.7 hole 1.1: 1(-2.54,0)
  round 1.7 hole 1.1: 2(0,0) 3(2.54,0)
HDR-TH_4P-P2.54-V-M
  rect 1.7x1.7 hole 1.1: 1(-3.81,0)
  round 1.7 hole 1.1: 2(-1.27,0) 3(1.27,0) 4(3.81,0)
HDR-TH_6P-P2.54-V-M-1
  rect 1.8x1.8 hole 1.2: 1(-6.35,0)
  round 1.8 hole 1.2: 2(-3.81,0) 3(-1.27,0) 4(1.27,0) 5(3.81,0) 6(6.35,0)
HDR-TH_6P-P2.54-V-M-R2-C3-S2.54-1
  rect 1.8x1.8 hole 1.05: 1(-2.54,-1.27)
  round 1.8 hole 1.05: 2(-2.54,1.27) 3(0,-1.27) 4(0,1.27) 5(2.54,-1.27) 6(2.54,1.27)
LED0603-RD
  rect 0.8x0.8 smd: 1(-0.799,0) 2(0.799,0)
OSC-SMD_3P-L3.2-W1.3-P1.20-L
  rect 0.6x1.4 smd: 1(-1.199,0) 2(0,0) 3(1.199,0)
R0402
  rect 0.566x0.54 smd: 1(-0.433,0) 2(0.433,0)
R0603
  rect 0.806x0.864 smd: 1(-0.753,0) 2(0.753,0)
SMD-28_L12.0-W12.0-P1.25_LORA-E5
  rect 2.3x1 smd: 1(-6,3.75) 2(-6,2.5) 3(-6,1.25) 4(-6,0) 5(-6,-1.25) 6(-6,-2.5) 7(-6,-3.75) 15(6,-3.75) 16(6,-2.5) 17(6,-1.25) 18(6,0) 19(6,1.25) 20(6,2.5) 21(6,3.75)
  rect 1x2.3 smd: 8(-3.75,-6) 9(-2.5,-6) 10(-1.25,-6) 11(0,-6) 12(1.25,-6) 13(2.5,-6) 14(3.75,-6) 22(3.75,6) 23(2.5,6) 24(1.25,6) 25(0,6) 26(-1.25,6) 27(-2.5,6) 28(-3.75,6)
SOD-323_L1.8-W1.3-LS2.5-RD
  rect 1x0.75 smd: 1(-1.173,0) 2(1.173,0)
SOT-23-5_L3.0-W1.7-P0.95-LS2.8-BL
  rect 0.49x1.157 smd: 1(-0.95,-1.153) 2(0,-1.153) 3(0.95,-1.153)
  rect 0.49x1.175 smd: 4(0.95,1.153) 5(-0.95,1.153)
SOT-23-5_L3.0-W1.7-P0.95-LS2.8-BR
  rect 1.1x0.6 smd: 1(1.3,-0.95) 2(1.3,0) 3(1.3,0.95) 4(-1.3,0.95) 5(-1.3,-0.95)
SOT-353-5_L2.0-W1.3-P0.65-LS2.1-BR
  rect 0.7x0.35 smd: 1(0.94,-0.65) 2(0.94,0) 3(0.94,0.65) 4(-0.94,0.65) 5(-0.94,-0.65)
SW-SMD_2P-L17.0-W3.1_REED_SWITCH_17MM
  rect 2.2x1.2 smd: 1(-8.712,-0.01) 2(8.585,-0.01)
SW-SMD_L4.0-W2.9-P4.15-EH
  rect 1.35x1.8 smd: 1(-2.075,0) 2(2.075,0)
SW-SMD_MSS12C02LS-HB2.0-1
  rect 0.7x1.8 smd: 1(-2.25,-1.425) 2(-0.75,-1.425) 3(2.25,-1.425)
  rect 1x0.8 smd: 4(-3.65,1.425) 4(-3.65,-0.775) 4(3.65,1.425) 4(3.65,-0.775)
TO-92-3_L4.5-W3.5-P1.27-L
  rect 1x1.2 hole 0.7x0.85: 1(-1.27,0)
  oval 1x1.2 hole 0.7x0.85: 2(0,0) 3(1.27,0)
TQFP-32_L7.0-W7.0-P0.80-LS9.0-BL
  oval 0.45x1.65 smd: 1(-2.8,-4.369) 2(-2,-4.369) 3(-1.2,-4.369) 4(-0.4,-4.369) 5(0.4,-4.369) 6(1.2,-4.369) 7(2,-4.369) 8(2.8,-4.369) 17(2.8,4.369) 18(2,4.369) 19(1.2,4.369) 20(0.4,4.369) 21(-0.4,4.369) 22(-1.2,4.369) 23(-2,4.369) 24(-2.8,4.369)
  oval 2.5x0.45 smd: 9(4.795,-2.8) 10(4.795,-2) 11(4.795,-1.2) 12(4.795,-0.4)
  oval 1.65x0.45 smd: 13(4.381,0.4) 14(4.381,1.2) 15(4.381,2) 16(4.381,2.8) 25(-4.381,2.8) 26(-4.381,2) 27(-4.381,1.2) 28(-4.381,0.4) 29(-4.381,-0.4) 30(-4.381,-1.2) 31(-4.381,-2) 32(-4.381,-2.8)

## Nets
As in the schematic.

Pads without a net: H3 5; SW3 1; U2 4; U7 3 4 5 6 7 8 11 12 13 18 19 20 21 23 25 26 27 28; U8 2 9 10 11 12 19 23 24 25 32

## Via types
v1: diameter 0.61, hole 0.305, Top Layer to Bottom Layer, 226 vias

## Routing (per net, layer and track width the routed paths; a pad name or vN(x,y) marks a point on that pad's centre or on a via; arc(x,y) is an arc through that point)
GND: length 7.1
  Top Layer w0.254: R5.1 31.17,8.25 v1(31.17,8.43) ; 27.29,17.96 27.29,19.79 27.27,19.81 ; U8.3 v1(28.89,16.51) ; U8.21 28.07,9.58 28.07,8.38 28.36,8.09 C9.1
  Top Layer w0.5: 41.17,16.72 C8.1
  Top Layer w0.6: RF1.3 58.38,11.64 58.38,11.22
  vias: v1(2.3,24.3) v1(2.3,18.3) v1(4.3,18.3) v1(4.3,2.3) v1(6.3,20.3) v1(6.3,18.3) v1(6.3,2.3) v1(8.3,22.3) v1(8.3,20.3) v1(8.3,18.3) v1(8.3,16.3) v1(8.3,4.3) v1(10.3,27.19) v1(10.92,12.06) v1(11.05,18.03) v1(11.81,18.03) v1(11.94,8.89) v1(11.94,7.55) v1(11.94,5.63) v1(12.3,27.19) v1(12.3,2.3) v1(12.39,22.91) v1(12.45,18.8) v1(12.57,18.03) v1(12.9,13.53) v1(13.37,23.8) v1(13.46,8.89) v1(13.46,7.55) v1(13.46,5.63) v1(13.46,4.14) v1(13.46,2.1) v1(14.1,23.8) v1(14.3,27.19) v1(14.6,11.43) v1(15.45,11.43) v1(16.34,11.43) v1(17.09,11.43) v1(17.39,25.59) v1(17.39,21.59) v1(18.61,8.89) v1(19.3,8.89) v1(19.39,25.59) v1(19.39,21.59) v1(20.03,8.89) v1(20.47,19.75) v1(20.76,8.89) v1(21.39,25.59) v1(21.39,17.59) v1(21.5,8.93) v1(21.84,21.72) v1(21.84,20.95) v1(21.84,20.27) v1(21.84,19.46) v1(22.57,21.72) v1(23.29,21.72) v1(23.39,25.59) v1(24.02,21.72) v1(24.76,21.72) v1(25.39,25.59) v1(25.4,15.75) v1(25.51,21.72) v1(26.18,15.75) v1(26.67,6.6) v1(26.92,12.95) v1(26.92,12.19) v1(26.92,11.43) v1(26.94,15.75) v1(27.39,25.59) v1(27.36,6.6) v1(27.69,12.95) v1(27.68,12.19) v1(27.68,11.43) v1(27.69,0.77) v1(28.09,6.6) v1(28.48,12.95) v1(28.47,12.19) v1(28.47,11.43) v1(28.81,6.6) v1(29.22,12.95) v1(29.22,12.19) v1(29.22,11.43) v1(29.84,25.56) v1(30.34,15.69) v1(31.7,21.16) v1(31.7,20.36) v1(31.7,19.55) v1(31.7,18.74) v1(32.64,9.55) v1(32.6,8.3) v1(32.6,6.3) v1(34.54,20.32) v1(34.54,9.55) v1(34.6,8.3) v1(34.6,6.3) v1(36.6,24.3) v1(36.6,22.3) v1(36.6,20.3) v1(36.6,18.3) v1(38.6,24.3) v1(38.6,22.3) v1(38.6,20.3) v1(38.6,18.3) v1(38.62,16.26) v1(38.6,14.3) v1(38.6,12.3) v1(38.6,10.3) v1(38.6,8.3) v1(40.6,14.3) v1(40.6,12.3) v1(40.6,10.3) v1(40.6,8.3) v1(42.6,24.3) v1(42.6,8.3) v1(44.6,24.3) v1(44.6,20.3) v1(44.6,8.3) v1(45.72,17.78) v1(45.72,10.64) v1(46.6,26.3) v1(46.6,24.3) v1(46.54,17.78) v1(46.6,16.3) v1(46.6,14.3) v1(46.6,12.3) v1(46.54,10.64) v1(46.6,2.3) v1(47.36,17.78) v1(47.36,10.64) v1(48.19,17.78) v1(48.19,10.64) v1(48.6,26.3) v1(48.6,24.3) v1(48.6,16.3) v1(48.6,14.3) v1(48.6,12.3) v1(48.6,2.3) v1(49.01,17.78) v1(49.01,10.64) v1(49.83,17.78) v1(49.83,10.64) v1(50.6,24.3) v1(50.6,6.3) v1(50.6,2.3) v1(52.6,24.3) v1(52.6,4.3) v1(52.6,2.3) v1(54.6,28.3) v1(54.6,20.3) v1(54.6,6.3) v1(54.6,4.3) v1(54.6,2.3) v1(56.6,28.3) v1(56.6,20.3) v1(56.6,8.3) v1(56.6,6.3) v1(56.6,4.3) v1(56.6,2.3) v1(57.15,9.14) v1(57.96,9.14) v1(58.6,28.3) v1(58.6,24.3) v1(58.6,20.3) v1(58.6,14.3) v1(58.6,8.3) v1(58.6,6.3) v1(58.6,4.3) v1(58.6,2.3) v1(58.75,9.14) v1(59.56,9.14) v1(60.32,12.57) v1(60.32,11.49) v1(60.32,10.62) v1(60.31,9.14) v1(60.6,28.3) v1(60.6,26.3) v1(60.6,24.3) v1(60.6,20.3) v1(60.6,18.3) v1(60.6,16.3) v1(60.6,8.3) v1(60.6,6.3) v1(60.6,4.3) v1(60.6,2.3) v1(61.03,9.27) v1(61.59,9.91) v1(61.85,12.57) v1(61.85,11.48) v1(61.85,10.54) v1(62.6,26.3) v1(62.6,24.3) v1(62.6,22.3) v1(62.6,20.3) v1(62.6,8.3) v1(62.6,6.3) v1(62.6,4.3) v1(62.6,2.3) v1(64.6,26.3) v1(64.6,24.3) v1(64.6,22.3) v1(64.6,20.3) v1(64.6,18.3) v1(64.6,14.3) v1(64.6,8.3) v1(64.6,6.3) v1(64.6,4.3)
VBATT: length 67.5
  Top Layer w0.254: C10.2 11.19,14.66 11.63,14.66 ; R17.2 v1(26.54,5.21) ; U4.5 19.3,14.04 18.47,14.04 ; 11.63,14.66 U3.5 ; 11.63,14.66 11.5,14.78 R1.2 11.5,16.13 11.66,16.28 11.96,16.28 11.97,16.3 12.77,16.3 12.78,16.28 15.06,16.28 ; U5.5 18.22,15.43 18.29,15.37 18.29,14.22 18.47,14.04 ; C5.1 11.18,20.57 10.41,21.34 10.09,21.34 9.91,21.52 9.91,24.13 11.18,25.4 H5.1 ; 18.47,14.04 18.47,12.18 C1.2
  Top Layer w0.3: 18.12,20.07 17.78,20.07 17.4,19.69 17.4,18.29 17.15,18.03 15.37,18.03 15.11,17.78 15.11,16.34 ; 15.06,16.28 15.11,16.22 15.11,15.75 15.43,15.43 U5.5
  Top Layer w0.4: U2.1 13.64,20.57 12.7,20.57 12.26,20.14 C5.1
  Top Layer w0.6: 9.89,14.13 9.89,19.8 10.23,20.14 C5.1 ; 9.89,14.13 9.89,11.44 10.38,10.96 v1(10.38,6.49) 10.4,6.47 10.4,5.19 10.02,4.81 SW3.2 ; 9.89,14.13 C10.2
  Bottom Layer w0.254: v1(10.38,6.49) 25.26,6.49 v1(26.54,5.21)
VCC: length 125.5
  Top Layer w0.254: 3.17,27.31 H2.3 3.17,25.02 3.81,24.38 3.81,23.02 U6.3 5.24,22.37 R10.2 ; R11.2 R9.2 34.98,14.35 v1(34.85,14.48) 34.85,14.98 R13.2 ; 28.51,19.97 C6.2
  Top Layer w0.4: 3.17,27.31 4.14,28.27 16.56,28.27 ; 28.12,18.98 28.36,19.21 C6.2
  Top Layer w0.6: 42.17,18.1 C8.2 ; 42.17,18.1 43.41,18.1 U7.1 ; 42.17,18.1 39.75,20.52 H3.4 39.75,28.18 ; 39.75,28.18 16.12,28.18 15.93,28 C3.1 16.01,22.53 U2.5 ; 39.75,28.18 53.35,28.18 53.97,27.56 H4.2 ; 28.09,16.95 26.47,16.95 26.49,16.96 U8.6 ; 28.09,16.95 U8.4 ; 28.09,16.95 28.09,14.62 v1(27.94,14.48) 26.42,14.48 25.69,13.75 U8.18 25.69,4.1 24.13,2.54 J1.2 ; 28.51,19.97 28.48,20 28.48,21.68 C7.2 28.45,21.78 28.45,28.18
  Bottom Layer w0.3: 27.94,14.48 28.24,14.18 34.55,14.18 v1(34.85,14.48)
ADC: length 3.5
  Top Layer w0.254: U8.22 28.89,8.71 29.79,7.8 R5.2 R19.1
OFF: length 9.1
  Top Layer w0.254: R7.2 19.1,16.46 19.18,16.38 U5.2 20.7,16.38 21.08,16 21.08,13.72 21.26,13.54 23.27,13.54 U8.13
PB3: length 14.9
  Top Layer w0.254: 18.05,9.89 18.03,9.91 ; 18.05,9.89 17.65,9.49 17.65,3.81 J1.4 ; 18.05,9.89 20.94,9.89 21.59,10.54 21.59,11.72 21.84,11.97 U8.15
RESET: length 46.7
  Top Layer w0.254: J1.5 15.62,5.08 14.86,4.32 14.86,1.2 15.04,1.02 23.5,1.02 26.92,4.44 31.37,4.44 31.55,4.62 31.55,5.96 31.75,6.16 31.75,9.91 30.61,11.05 30.61,14.1 ; v1(30.61,14.86) 30.61,14.1 ; 30.61,14.1 30.88,14.37 U8.29 33.04,14.37 33.78,15.11 R13.1 ; v1(31.12,22.22) 31.66,22.22 C11.1
  Bottom Layer w0.254: v1(31.12,22.22) 31.12,15.37 v1(30.61,14.86)
RXD: length 19.4
  Top Layer w0.254: U8.30 32.95,15.17 v1(33.21,15.43) 33.53,15.75 33.53,16.26 33.71,16.44 34.06,16.44 R16.1 ; v1(32.77,18.29) 32.77,21.06 33.49,21.79 33.49,26.76 33.94,27.21 36.67,27.21 37.21,26.67 H3.3
  Bottom Layer w0.254: v1(32.77,18.29) 32.77,15.88 33.15,15.49
SCK: length 11.8
  Top Layer w0.254: U8.17 24.89,9.59 24.89,4.44 24.38,3.94 22.51,3.94 22.48,3.9 20.45,3.9 20.41,3.94 20.07,3.94 J1.3
SCL: length 35.2
  Top Layer w0.254: U8.28 v1(33.13,13.57) 33.4,13.84 R9.1
  Bottom Layer w0.254: H4.3 53.34,22.99 42.16,22.99 41.98,22.81 41.98,20.39 40.83,19.24 35.62,19.24 35.43,19.05 35.43,13.84 35.16,13.57 v1(33.13,13.57)
SDA: length 37.5
  Top Layer w0.254: U8.27 33.08,12.77 33.27,12.57 R11.1
  Bottom Layer w0.254: H4.4 55.52,22.63 42.67,22.63 42.42,22.38 42.42,20.19 39.75,17.53 35.94,17.53 35.83,17.41 35.83,13.6 34.42,12.19 33.66,12.19 v1(33.15,12.7)
SW_STATUS: length 13.2
  Top Layer w0.254: R8.1 12.52,11.07 13.05,10.54 20.96,10.54 21.13,10.72 21.13,12.24 21.59,12.7 23.23,12.7 U8.14
TEMP: length 43.7
  Top Layer w0.254: U6.2 3.17,21.08 4.95,21.08 5.17,21.3 R10.1 6.22,21.3 6.48,21.55 6.48,23.37 5.72,24.13 H2.2 ; v1(30.15,23.19) 30.1,23.14 30.1,20.07 30.48,19.69 30.48,18.34 U8.1
  Bottom Layer w0.254: v1(30.15,23.19) 16.85,23.19 16.38,23.65 16.38,27.05 15.24,28.19 6.22,28.19 5.72,27.69 H2.2
TXD: length 12.2
  Top Layer w0.254: 33.4,17.71 33.33,17.71 33.15,17.53 33.15,17 33.17,16.98 33.17,16.56 32.58,15.97 U8.31 ; 33.4,17.71 33.4,20.95 34.04,21.59 34.04,25.4 H3.2 ; 33.4,17.71 34.06,17.71 R15.1
WAKEUP: length 11.3
  Top Layer w0.2: H5.2 13.84,25.02 14.93,23.93 14.93,18.87 14.86,18.8
  Top Layer w0.254: R6.1 D2.1 13.71,17.04 U2.3 14.8,18.73 14.86,18.8
WIORST: length 2.6
  Top Layer w0.254: R14.1 34.07,11.27 33.49,11.27 33.33,11.43 33.33,11.79 33.15,11.97 U8.26
$1N10294: length 2.2
  Top Layer w0.254: 25.69,17.96 25.69,18.95 25.84,19.11 X1.3
$1N16067: length 3.4
  Top Layer w0.254: 24.89,17.96 24.89,18.62 23.67,18.62 23.5,18.8 23.5,20.01 X1.1
$1N25630: length 1.9
  Top Layer w0.254: U8.20 27.27,9.58 27.27,7.75
$1N31677: length 9.6
  Top Layer w0.254: U7.15 56.71,10.47 57.15,10.03 60.45,10.03 arc(60.81,10.18) 60.96,10.54 RF1.5
$1N31679: length 1.7
  Top Layer w0.254: R12.1 61.1,22.35 SW2.2
$1N31680: length 6.9
  Top Layer w0.254: U7.24 50.67,20.33 50.67,21.97 51.05,22.35 SW2.1
$1N31682: length 34.5
  Top Layer w0.254: U7.17 55.55,12.95 v1(57.15,12.95) ; v1(50.67,5.08) 50.55,4.95 35.94,4.95 35.81,5.08 35.81,10.47 R14.2
  Bottom Layer w0.254: v1(57.15,12.95) 57.15,12.44 56.99,12.28 56.99,10.05 56.5,9.56 55.15,9.56 v1(50.67,5.08)
$1N31686: length 25.9
  Top Layer w0.254: R16.2 35.81,16.38 36.32,15.88 36.32,5.59 36.45,5.46 46.99,5.46 47.81,6.28 47.81,7.75 U7.10
$1N31687: length 24.3
  Top Layer w0.254: U7.9 47.03,6.52 46.61,6.1 37.08,6.1 36.83,6.35 36.83,15.8 36.68,15.95 36.68,16.02 35.05,17.65 R15.2
$1N33212: length 3.5
  Top Layer w0.6: H1.1 D1.2
$1N40469: length 1.9
  Top Layer w0.254: U5.1 20.45,14.95 R4.1
$1N40521: length 2.7
  Top Layer w0.254: 16.17,12.7 16.13,12.74 16.13,13.36 ; R3.1 16.13,13.77 16.13,13.36 ; 16.13,13.36 16.15,13.33 U4.2
$1N40626: length 1.2
  Top Layer w0.254: U4.4 19.67,12.69 19.94,12.95 20.4,12.95 R4.2
$1N40794: length 37
  Top Layer w0.254: 28.06,2.29 27.89,2.29 26.27,0.66 14.89,0.66 14.5,1.05 14.5,9.88 14.35,10.03 12.95,10.03 11.92,11.06 U3.1 11.92,13.45 12.37,13.89 12.37,14.18 12.38,14.19 12.38,15.12 12.37,15.13 R1.1 13.21,15.75 14.1,14.86 16.26,14.86 17.13,13.98 U4.1
$1N41071: length 5.4
  Top Layer w0.254: 13.34,13.97 13.68,13.63 13.68,12.99 13.84,12.83 13.84,11.89 R8.2 ; 13.34,13.97 R3.2 ; 13.34,13.97 13.22,14.08 U3.4
$1N41432: length 3.8
  Top Layer w0.254: D2.2 17.05,17.02 U5.4 18.09,17.33 18.29,17.53 18.29,18.74 18.24,18.8
$1N45378: length 10.9
  Top Layer w0.6: D3.2 7.75,10.7 v1(7.75,11.68) v1(7.75,12.43) v1(7.75,13.18) v1(7.75,13.93) v1(7.75,14.68) v1(7.75,15.43)
  Bottom Layer w0.254: BT1.1 3.88,14.68 v1(7.75,14.68)
$1N45496: length 1.3
  Top Layer w0.254: R17.1 R18.1
$1N45505: length 1.3
  Top Layer w0.254: R19.2 R18.2
$1N45731: length 7.2
  Top Layer w0.6: SW3.3 7.02,4.99 7.91,5.88 8.93,5.88 9.05,6 D1.1 D3.1
$1N46027: length 2.2
  Top Layer w0.254: LED2.2 23.62,10.85 U8.16
$1N46075: length 1.5
  Top Layer w0.254: LED2.1 23.62,6.01 R20.2
$1N46271: length 2.2
  Top Layer w0.254: H3.1 C11.2

## Copper pours and planes (outline as drawn; the poured copper is in the pictures)
GND on Top Layer: 65.72,-0.13 0.13,-0.13 0.13,28.83 65.72,28.83
GND on Bottom Layer: 0,28.83 65.91,28.83 65.91,0.25 0,0.25
$1N45378 on Bottom Layer: 6.48,16.26 8.38,16.26 8.38,10.92 6.48,10.92

## Text on the board
Bottom Silkscreen Layer: TX | RX | 3.3V | GND | - | + | SCL | SDA | -  D  + | +.D.- | Ext. DSB1820 | LoRA Tx/Rx Version 1.00 / 11/08/25
Top Silkscreen Layer: ISP Prog | DS18B20 | - | + | SCL | SDA | FTDI | D | TX | RX | Ext. DS18B20 | ON<-- | GADJET | -short to stay powered | LoRA Tx V1.0 | Batt.
